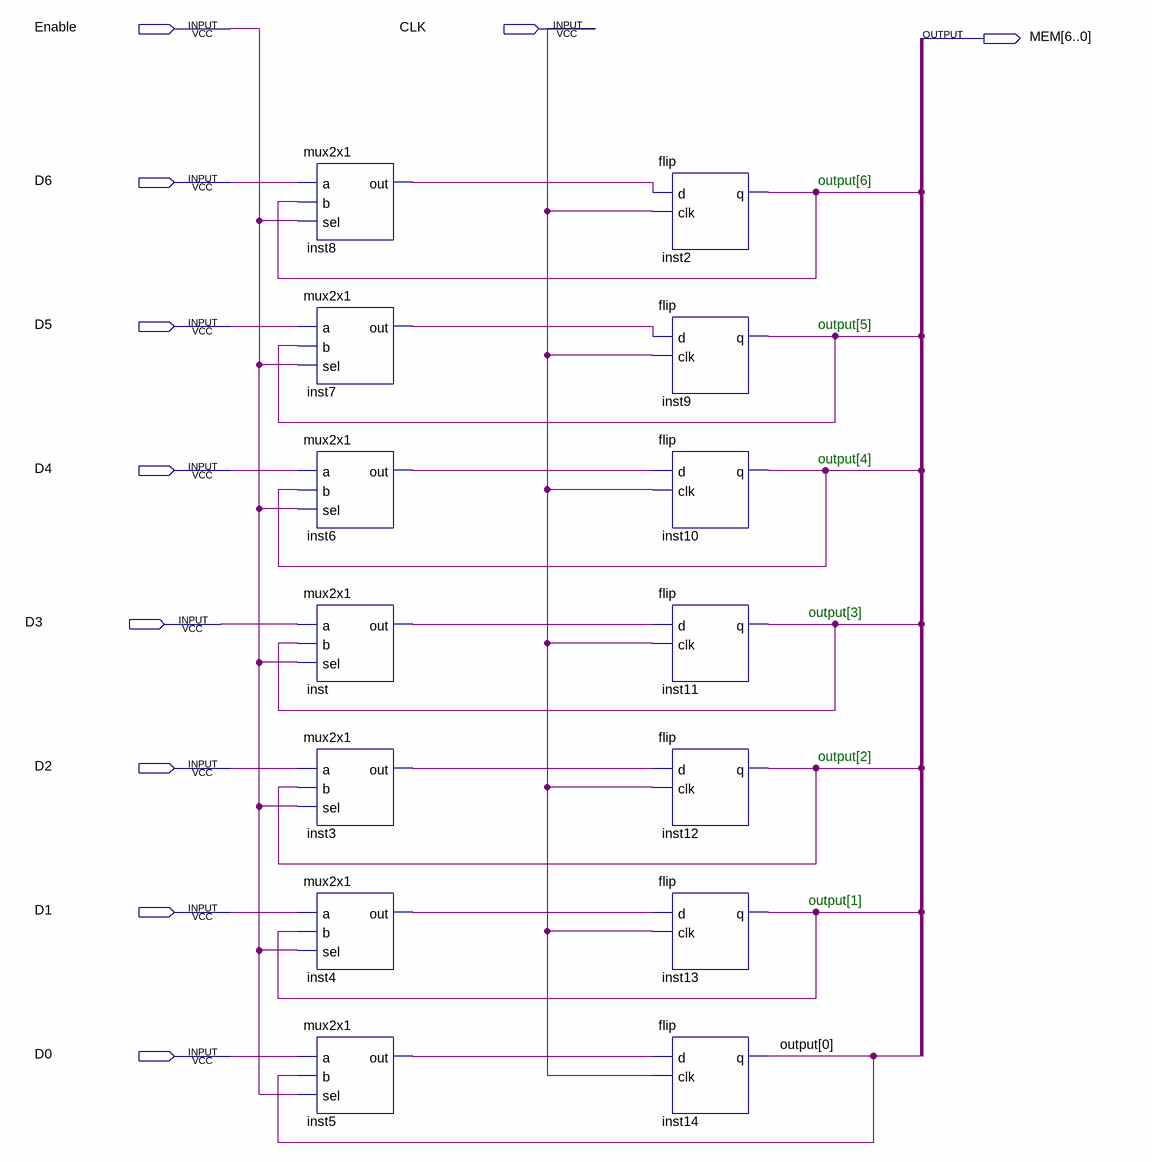
[diagram p0: schematic sheet]
// Quartus schematic memory_system_block.bdf as structural Verilog: 14 symbols, 10 pins
module memory_system_block (
  input  Enable,
  input  CLK,
  input  D6,
  input  D5,
  input  D4,
  input  D3,
  input  D2,
  input  D1,
  input  D0,
  output [6:0] MEM
);

  wire inst2_q, inst3_out, inst4_out, inst5_out, inst6_out, inst7_out, inst8_out, inst9_q, inst10_q,
       inst11_q, inst12_q, inst13_q, inst_out;
  wire [0:0] \output ;

  mux2x1 inst8 (.a(D6), .b(inst2_q), .sel(Enable), .out(inst8_out));
  mux2x1 inst7 (.a(D5), .b(inst9_q), .sel(Enable), .out(inst7_out));
  mux2x1 inst6 (.a(D4), .b(inst10_q), .sel(Enable), .out(inst6_out));
  mux2x1 inst (.a(D3), .b(inst11_q), .sel(Enable), .out(inst_out));
  mux2x1 inst3 (.a(D2), .b(inst12_q), .sel(Enable), .out(inst3_out));
  mux2x1 inst4 (.a(D1), .b(inst13_q), .sel(Enable), .out(inst4_out));
  mux2x1 inst5 (.a(D0), .b(\output [0]), .sel(Enable), .out(inst5_out));
  flip inst2 (.d(inst8_out), .clk(CLK), .q(inst2_q));
  flip inst9 (.d(inst7_out), .clk(CLK), .q(inst9_q));
  flip inst10 (.d(inst6_out), .clk(CLK), .q(inst10_q));
  flip inst11 (.d(inst_out), .clk(CLK), .q(inst11_q));
  flip inst12 (.d(inst3_out), .clk(CLK), .q(inst12_q));
  flip inst13 (.d(inst4_out), .clk(CLK), .q(inst13_q));
  flip inst14 (.d(inst5_out), .clk(CLK), .q(\output [0]));

  // Notes on the sheet:
  //   output[6]
  //   output[5]
  //   output[4]
  //   output[3]
  //   output[2]
  //   output[1]
endmodule
